# Altium project Main Board.PrjPCB
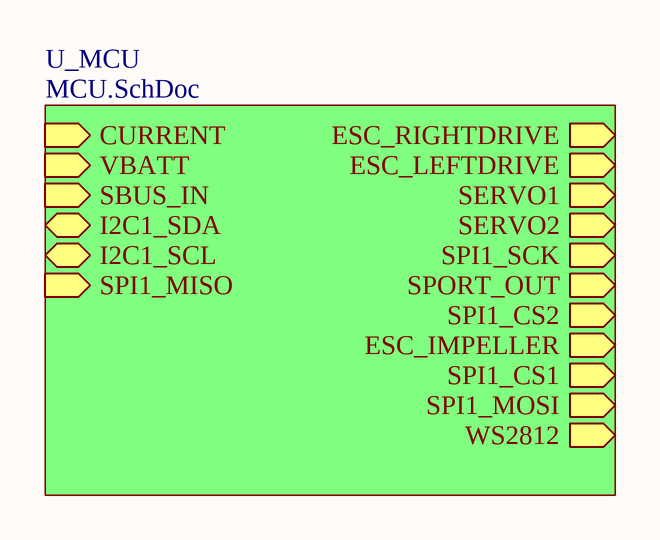
[diagram p0: Control_Board.SchDoc]
3 sheets, 2 parts. Net scope: hierarchical (ports join the sheet entries above them; power ports are global).
Sheets:
  Control_Board.SchDoc
    U_MCU = MCU.SchDoc
  Sensors.SchDoc

## Sheet Control_Board.SchDoc
size A4

### Sub-sheets
U_MCU = MCU.SchDoc: ESC_RIGHTDRIVE (out), ESC_LEFTDRIVE (out), CURRENT (in), VBATT (in), SERVO1 (out), SERVO2 (out), SPI1_SCK (out), SPORT_OUT (out), SBUS_IN (in), SPI1_CS2 (out), I2C1_SDA (bidir), I2C1_SCL (bidir), ESC_IMPELLER (out), SPI1_CS1 (out), SPI1_MOSI (out), SPI1_MISO (in), WS2812 (out)

## Sheet MCU.SchDoc
size A4
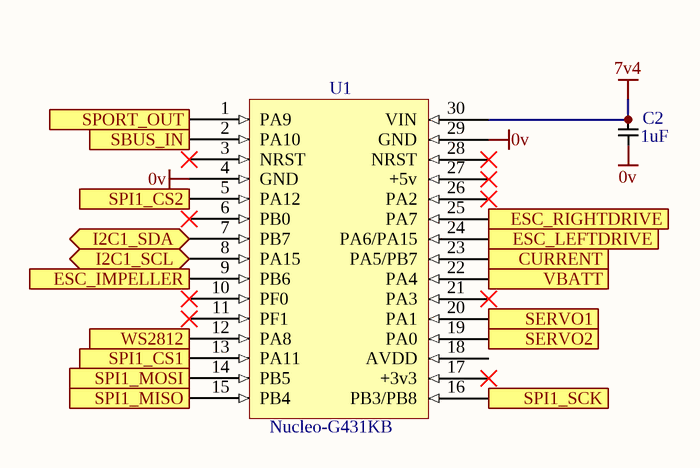
[diagram p1: MCU.SchDoc]

### Parts
C2  1uF  [0805]
U1  Nucleo-G431KB  [nucleo]

### Ports
CURRENT (in), ESC_IMPELLER (out), ESC_LEFTDRIVE (out), ESC_RIGHTDRIVE (out), I2C1_SCL (bidir), I2C1_SDA (bidir), SBUS_IN (in), SERVO1 (out), SERVO2 (out), SPI1_CS1 (out), SPI1_CS2 (out), SPI1_MISO (in), SPI1_MOSI (out), SPI1_SCK (out), SPORT_OUT (out), VBATT (in), WS2812 (out)

### Nets
0v: C2.2 U1.4(GND) U1.29(GND)
7v4: C2.1 U1.30(VIN)
NetU1_1: U1.1(PA9) ; port SPORT_OUT
NetU1_2: U1.2(PA10) ; port SBUS_IN
NetU1_5: U1.5(PA12) ; port SPI1_CS2
NetU1_7: U1.7(PB7) ; port I2C1_SDA
NetU1_8: U1.8(PA15) ; port I2C1_SCL
NetU1_9: U1.9(PB6) ; port ESC_IMPELLER
NetU1_12: U1.12(PA8) ; port WS2812
NetU1_13: U1.13(PA11) ; port SPI1_CS1
NetU1_14: U1.14(PB5) ; port SPI1_MOSI
NetU1_15: U1.15(PB4) ; port SPI1_MISO
NetU1_16: U1.16(PB3/PB8) ; port SPI1_SCK
NetU1_19: U1.19(PA0) ; port SERVO2
NetU1_20: U1.20(PA1) ; port SERVO1
NetU1_22: U1.22(PA4) ; port VBATT
NetU1_23: U1.23(PA5/PB7) ; port CURRENT
NetU1_24: U1.24(PA6/PA15) ; port ESC_LEFTDRIVE
NetU1_25: U1.25(PA7) ; port ESC_RIGHTDRIVE

Not connected (* = marked no-connect by the designer): U1 3(NRST)* 6(PB0)* 10(PF0)* 11(PF1)* 17(+3v3)* 18(AVDD) 21(PA3)* 26(PA2)* 27(+5v)* 28(NRST)*

### Library data of the parts
C2 = Capacitor

## Sheet Sensors.SchDoc
size A3